# Altium schematic sheet NEB_SRAM.SchDoc
size A4; Organization: Altium Limited; Address1: L3, 12a Rodborough Rd; Address2: Frenchs Forest; Address3: NSW; Address4: Australia 2086; DocumentNumber: 10; SheetNumber: 10; SheetTotal: 10
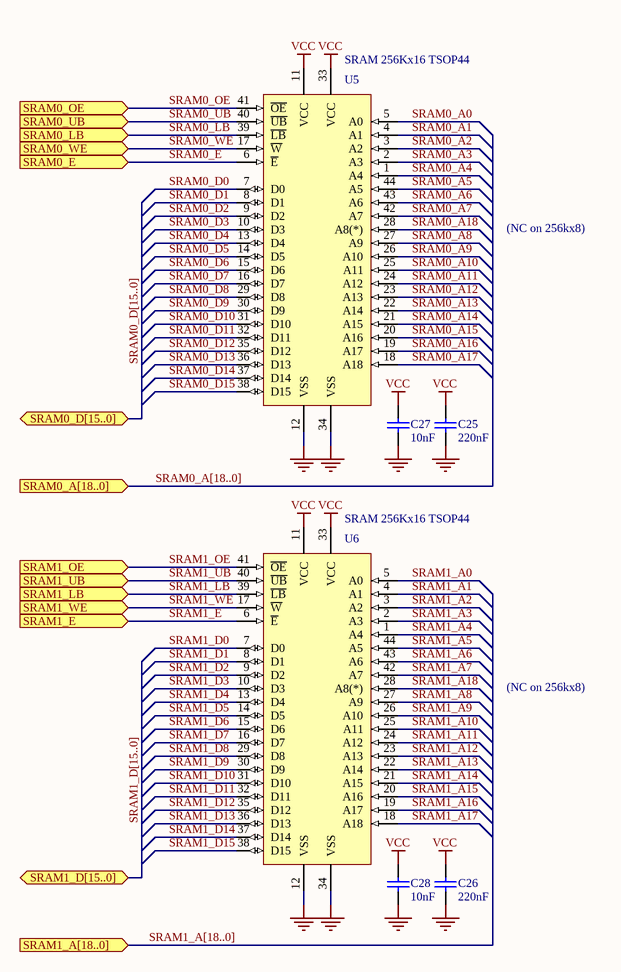
[diagram p0: NEB_SRAM.SchDoc]

## Parts
C25  220nF  [CC2012-0805]
C26  220nF  [CC2012-0805]
C27  10nF  [CC2012-0805]
C28  10nF  [CC2012-0805]
U5  SRAM 256Kx16 TSOP44  [SO-G44/P.8]
U6  SRAM 256Kx16 TSOP44  [SO-G44/P.8]

## Ports
SRAM0_A[18..0] (in), SRAM0_D[15..0] (bidir), SRAM0_E (in), SRAM0_LB (in), SRAM0_OE (in), SRAM0_UB (in), SRAM0_WE (in), SRAM1_A[18..0] (in), SRAM1_D[15..0] (bidir), SRAM1_E (in), SRAM1_LB (in), SRAM1_OE (in), SRAM1_UB (in), SRAM1_WE (in)

## Nets
GND: C25.1 C26.1 C27.1 C28.1 U5.12(VSS) U5.34(VSS) U6.12(VSS) U6.34(VSS)
VCC: C25.2 C26.2 C27.2 C28.2 U5.11(VCC) U5.33(VCC) U6.11(VCC) U6.33(VCC)
SRAM0_A0: U5.5(A0)
SRAM0_A1: U5.4(A1)
SRAM0_A2: U5.3(A2)
SRAM0_A3: U5.2(A3)
SRAM0_A4: U5.1(A4)
SRAM0_A5: U5.44(A5)
SRAM0_A6: U5.43(A6)
SRAM0_A7: U5.42(A7)
SRAM0_A8: U5.27(A9)
SRAM0_A9: U5.26(A10)
SRAM0_A10: U5.25(A11)
SRAM0_A11: U5.24(A12)
SRAM0_A12: U5.23(A13)
SRAM0_A13: U5.22(A14)
SRAM0_A14: U5.21(A15)
SRAM0_A15: U5.20(A16)
SRAM0_A16: U5.19(A17)
SRAM0_A17: U5.18(A18)
SRAM0_A18: U5.28(A8(*))
SRAM0_D0: U5.7(D0)
SRAM0_D1: U5.8(D1)
SRAM0_D2: U5.9(D2)
SRAM0_D3: U5.10(D3)
SRAM0_D4: U5.13(D4)
SRAM0_D5: U5.14(D5)
SRAM0_D6: U5.15(D6)
SRAM0_D7: U5.16(D7)
SRAM0_D8: U5.29(D8)
SRAM0_D9: U5.30(D9)
SRAM0_D10: U5.31(D10)
SRAM0_D11: U5.32(D11)
SRAM0_D12: U5.35(D12)
SRAM0_D13: U5.36(D13)
SRAM0_D14: U5.37(D14)
SRAM0_D15: U5.38(D15)
SRAM0_E: U5.6(~{E}) ; port SRAM0_E
SRAM0_LB: U5.39(~{LB}) ; port SRAM0_LB
SRAM0_OE: U5.41(~{OE}) ; port SRAM0_OE
SRAM0_UB: U5.40(~{UB}) ; port SRAM0_UB
SRAM0_WE: U5.17(~{W}) ; port SRAM0_WE
SRAM1_A0: U6.5(A0)
SRAM1_A1: U6.4(A1)
SRAM1_A2: U6.3(A2)
SRAM1_A3: U6.2(A3)
SRAM1_A4: U6.1(A4)
SRAM1_A5: U6.44(A5)
SRAM1_A6: U6.43(A6)
SRAM1_A7: U6.42(A7)
SRAM1_A8: U6.27(A9)
SRAM1_A9: U6.26(A10)
SRAM1_A10: U6.25(A11)
SRAM1_A11: U6.24(A12)
SRAM1_A12: U6.23(A13)
SRAM1_A13: U6.22(A14)
SRAM1_A14: U6.21(A15)
SRAM1_A15: U6.20(A16)
SRAM1_A16: U6.19(A17)
SRAM1_A17: U6.18(A18)
SRAM1_A18: U6.28(A8(*))
SRAM1_D0: U6.7(D0)
SRAM1_D1: U6.8(D1)
SRAM1_D2: U6.9(D2)
SRAM1_D3: U6.10(D3)
SRAM1_D4: U6.13(D4)
SRAM1_D5: U6.14(D5)
SRAM1_D6: U6.15(D6)
SRAM1_D7: U6.16(D7)
SRAM1_D8: U6.29(D8)
SRAM1_D9: U6.30(D9)
SRAM1_D10: U6.31(D10)
SRAM1_D11: U6.32(D11)
SRAM1_D12: U6.35(D12)
SRAM1_D13: U6.36(D13)
SRAM1_D14: U6.37(D14)
SRAM1_D15: U6.38(D15)
SRAM1_E: U6.6(~{E}) ; port SRAM1_E
SRAM1_LB: U6.39(~{LB}) ; port SRAM1_LB
SRAM1_OE: U6.41(~{OE}) ; port SRAM1_OE
SRAM1_UB: U6.40(~{UB}) ; port SRAM1_UB
SRAM1_WE: U6.17(~{W}) ; port SRAM1_WE

## Buses and harness runs
bus SRAM0_A[18..0] = port SRAM0_A[18..0]
bus SRAM0_D[15..0] = port SRAM0_D[15..0]
bus SRAM1_A[18..0] = port SRAM1_A[18..0]
bus SRAM1_D[15..0] = port SRAM1_D[15..0]

## Notes on the sheet
- (NC on 256kx8)
- Title
- Size:
- Date:
- A4
- Number:
- Time:
- Revision:
- Sheet
- of
- File:

## Library data of the parts
C25-C28 = CAP: Capacitor; Supplier: FARNELL; Supplier Code: 335-2020
U5 U6 = SRAM 512Kx16 TSOP44: 512Kx16Bit SRAM TSOP44